# EAGLE design rcal (EAGLE 6.5.0)
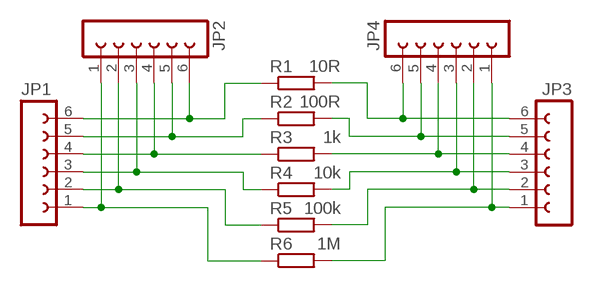
[diagram p0: schematic, sheet 1]

## Parts
JP1  FE06-1  [FE06]
JP2  FE06-1  [FE06]
JP3  FE06-1  [FE06]
JP4  FE06-1  [FE06]
R1  10R  R-EU_R0805  [R0805]
R2  100R  R-EU_R0805  [R0805]
R3  1k  R-EU_R0805  [R0805]
R4  10k  R-EU_R0805  [R0805]
R5  100k  R-EU_R0805  [R0805]
R6  1M  R-EU_R0805  [R0805]

## Nets
N$1: JP1.6 JP2.6 R1.1
N$2: JP1.5 JP2.5 R2.1
N$3: JP1.4 JP2.4 R3.1
N$4: JP1.3 JP2.3 R4.1
N$5: JP1.2 JP2.2 R5.1
N$6: JP1.1 JP2.1 R6.1
N$7: JP3.6 JP4.6 R1.2
N$8: JP3.5 JP4.5 R2.2
N$9: JP3.4 JP4.4 R3.2
N$10: JP3.3 JP4.3 R4.2
N$11: JP3.2 JP4.2 R5.2
N$12: JP3.1 JP4.1 R6.2

## Library data of the parts
JP1-JP4 = con-lsta:FE06-1: FEMALE HEADER; OC_FARNELL: unknown; OC_NEWARK: unknown
R1-R6 = rcl:R-EU_: RESISTOR, European symbol

## Board
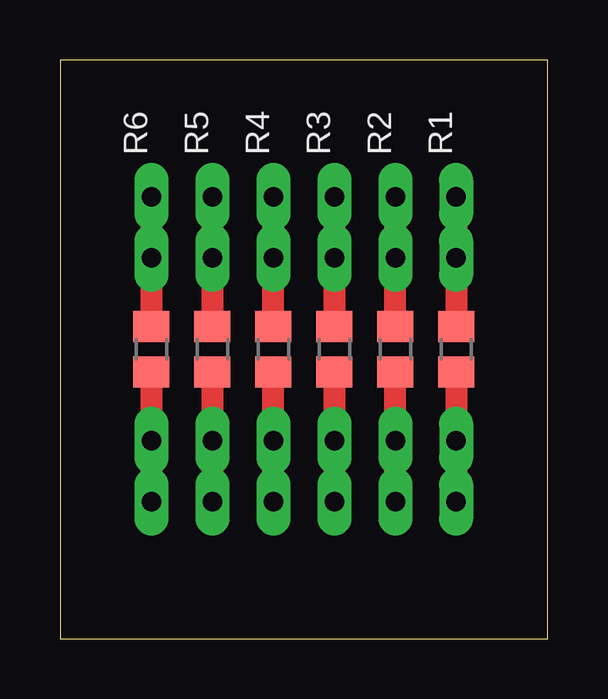
[diagram p1: board, top side]
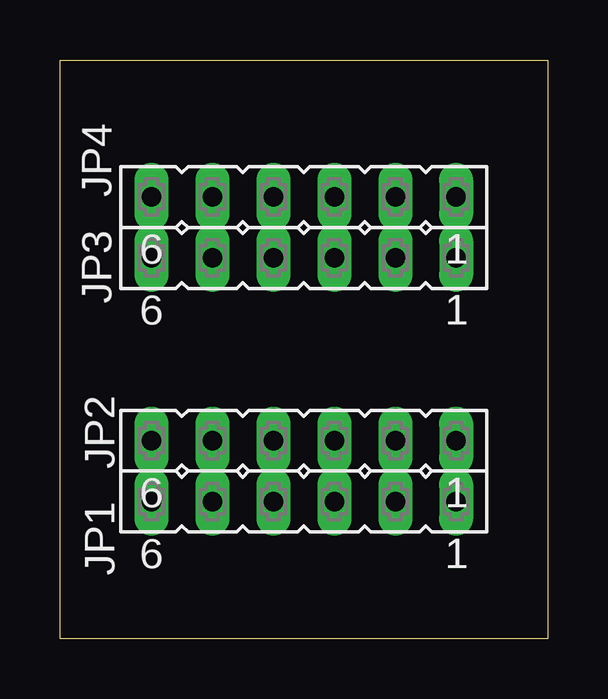
[diagram p2: board, bottom side, seen from below]

Size 20.32 x 24.13 mm. Coordinates in mm from the lower left corner, seen from the top.
Outline: 0,0 20.32,0 20.32,24.13 0,24.13 0,0
Copper layers (1*16): Top 0.035mm / dielectric 1.5mm / Bottom 0.035mm
Design rules "ime": minimum track width 10mil, minimum drill 0.8mm, track to track 10mil, track to pad 10mil, pad to pad 10mil, via to via 10mil, smd to smd 8mil, copper to edge 100mil, drill to drill 8mil, minimum pad ring 12mil, minimum via ring 12mil, stop-mask expansion 4mil, vias tented up to drill 0mil, thermal gap 10mil

### Footprints (pad centres in the part's own frame; a part is rotated, then mirrored left to right if it is on the bottom)
FE06 = drill 0.813 long: 1 -6.35,0; 2 -3.81,0; 3 -1.27,0; 4 1.27,0; 5 3.81,0; 6 6.35,0
R0805 = smd 1.3 x 1.5: 1 -0.95,0; 2 0.95,0

### Placement (x,y rotation side)
JP1  10.16,5.71 180 bottom
JP2  10.16,8.26 180 bottom
JP3  10.16,15.88 180 bottom
JP4  10.16,18.41 180 bottom
R1  16.51,12.06 90 top
R2  13.97,12.06 90 top
R3  11.43,12.06 90 top
R4  8.89,12.06 90 top
R5  6.35,12.06 90 top
R6  3.81,12.06 90 top

### Tracks (layer width: path | path; a pad name or v marks a point on that pad's centre or on a via)
N$1
  Top 0.914: R1.1 JP2.6 JP1.6
N$2
  Top 0.914: JP1.5 JP2.5 R2.1
N$3
  Top 0.914: R3.1 JP2.4 JP1.4
N$4
  Top 0.914: JP1.3 JP2.3 R4.1
N$5
  Top 0.914: R5.1 JP2.2 JP1.2
N$6
  Top 0.914: R6.1 JP2.1 JP1.1
N$7
  Top 0.914: JP4.6 JP3.6 R1.2
N$8
  Top 0.914: R2.2 JP3.5 JP4.5
N$9
  Top 0.914: JP4.4 JP3.4 R3.2
N$10
  Top 0.914: R4.2 JP3.3 JP4.3
N$11
  Top 0.914: JP4.2 JP3.2 R5.2
N$12
  Top 0.914: JP4.1 JP3.1 R6.2

### Text on the board
tDocu: Impedance Spectrometer / Calibration Resistors